# Altium schematic sheet PowerMeasure.SchDoc
size A4; PageSetup: Record=PageOptions|CenterHorizontal=True|CenterVertical=True|PrintScale=0.96|XCorrection=1.00|YCorrection=1.00|PrintKind=2|BorderSize=5000000|LeftOffset=0|BottomOffset=0|Orientation=2|PaperLength=1000|PaperWidth=1000|Scale=100|PaperSource=7|PrintQuality=-4|MediaType=1|DitherType=10|PaperKind=A4|PrintScaleMode=1
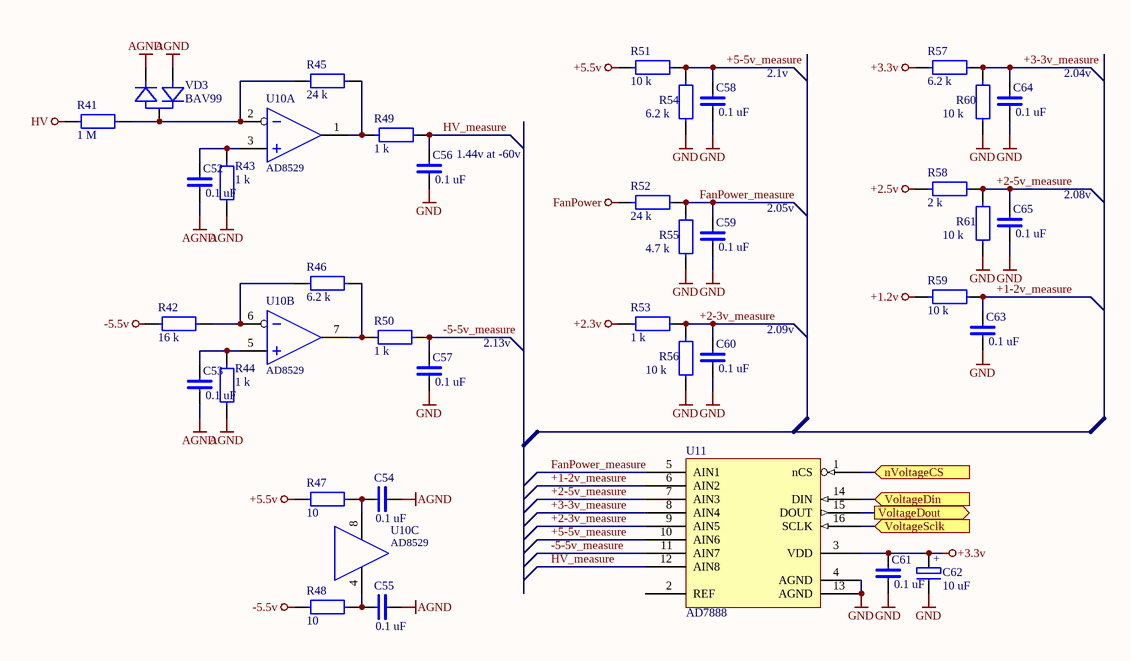
[diagram p0: PowerMeasure.SchDoc]

## Parts
C52  0.1 uF  [0603]
C53  0.1 uF  [0603]
C54  0.1 uF  [0603]
C55  0.1 uF  [0603]
C56  0.1 uF  [0603]
C57  0.1 uF  [0603]
C58  0.1 uF  [0603]
C59  0.1 uF  [0603]
C60  0.1 uF  [0603]
C61  0.1 uF  [0603]
C62  10 uF  [CP3216]
C63  0.1 uF  [0603]
C64  0.1 uF  [0603]
C65  0.1 uF  [0603]
R41  1 M  [1206]
R42  16 k  [1206]
R43  1 k  [0603]
R44  1 k  [0603]
R45  24 k  [1206]
R46  6.2 k  [1206]
R47  10  [0603]
R48  10  [0603]
R49  1 k  [0603]
R50  1 k  [0603]
R51  10 k  [0603]
R52  24 k  [1206]
R53  1 k  [0603]
R54  6.2 k  [1206]
R55  4.7 k  [1206]
R56  10 k  [0603]
R57  6.2 k  [1206]
R58  2 k  [1206]
R59  10 k  [0603]
R60  10 k  [0603]
R61  10 k  [0603]
U10  AD8529  [8SOIC150]  (parts A,B,C of 3)
U11  AD7888  [16SOIC150]
VD3  BAV99  [SOT-23]

## Ports
nVoltageCS (in), VoltageDin (in), VoltageDout (out), VoltageSclk (in)

## Nets
+1.2v: R59.2
+2.3v: R53.2
+2.5v: R58.2
+3.3v: C61.2 C62.+ R57.2 U11.3(VDD)
+5.5v: R47.1 R51.2
-5.5v: R42.1 R48.1
AGND: C52.1 C53.1 C54.1 C55.1 R43.1 R44.1 VD3.1 VD3.2
FanPower: R52.2
GND: C56.1 C57.1 C58.1 C59.1 C60.1 C61.1 C62.- C63.1 C64.1 C65.1 R54.1 R55.1 R56.1 R60.1 R61.1 U11.4(AGND) U11.13(AGND)
HV: R41.1
+1-2v_measure: C63.2 R59.1 U11.6(AIN2)
+2-3v_measure: C60.2 R53.1 R56.2 U11.9(AIN5)
+2-5v_measure: C65.2 R58.1 R61.2 U11.7(AIN3)
+3-3v_measure: C64.2 R57.1 R60.2 U11.8(AIN4)
+5-5v_measure: C58.2 R51.1 R54.2 U11.10(AIN6)
-5-5v_measure: C57.2 R50.2 U11.11(AIN7)
FanPower_measure: C59.2 R52.1 R55.2 U11.5(AIN1)
HV_measure: C56.2 R49.1 U11.12(AIN8)
nVoltageCS: U11.1(nCS) ; port nVoltageCS
VoltageDin: U11.14(DIN) ; port VoltageDin
VoltageDout: U11.15(DOUT) ; port VoltageDout
VoltageSclk: U11.16(SCLK) ; port VoltageSclk
NetC52_2: C52.2 R43.2 U10.3(IN+)
NetC53_2: C53.2 R44.2 U10.5(IN+)
NetC54_2: C54.2 R47.2 U10.8(V+)
NetC55_2: C55.2 R48.2 U10.4(V-)
NetR41_2: R41.2 R45.1 U10.2(IN-) VD3.3
NetR42_2: R42.2 R46.1 U10.6(IN-)
NetR45_2: R45.2 R49.2 U10.1(OUT)
NetR46_2: R46.2 R50.1 U10.7(OUT)

Not connected (* = marked no-connect by the designer): U11 2(REF)

## Notes on the sheet
- 2.1v
- 2.04v
- 1.44v at -60v
- 2.05v
- 2.08v
- 2.13v
- 2.09v

## Library data of the parts
C52 C53 C56-C61 C63-C65 = C
C54 C55 = c
C62 = C POL
R41-R48 = r
R49-R61 = R
U10 = AD8529: 8 MHz Rail-to-Rail Operational Amplifiers; Value: AD8529
U11 = AD7888: 8-Channel, 125 kSPS, 12-Bit ADC; BodyName: *; Instance: *; PartName: *; PLACEMENT_REGION: *; CompValue: *; Right: *; Bottom: *; SymName: *; RefLocation: *; BoardLocation: *; SlotXofY: *
VD3 = BAV99: Double diode